# Altium schematic sheet STM.SchDoc
size A4
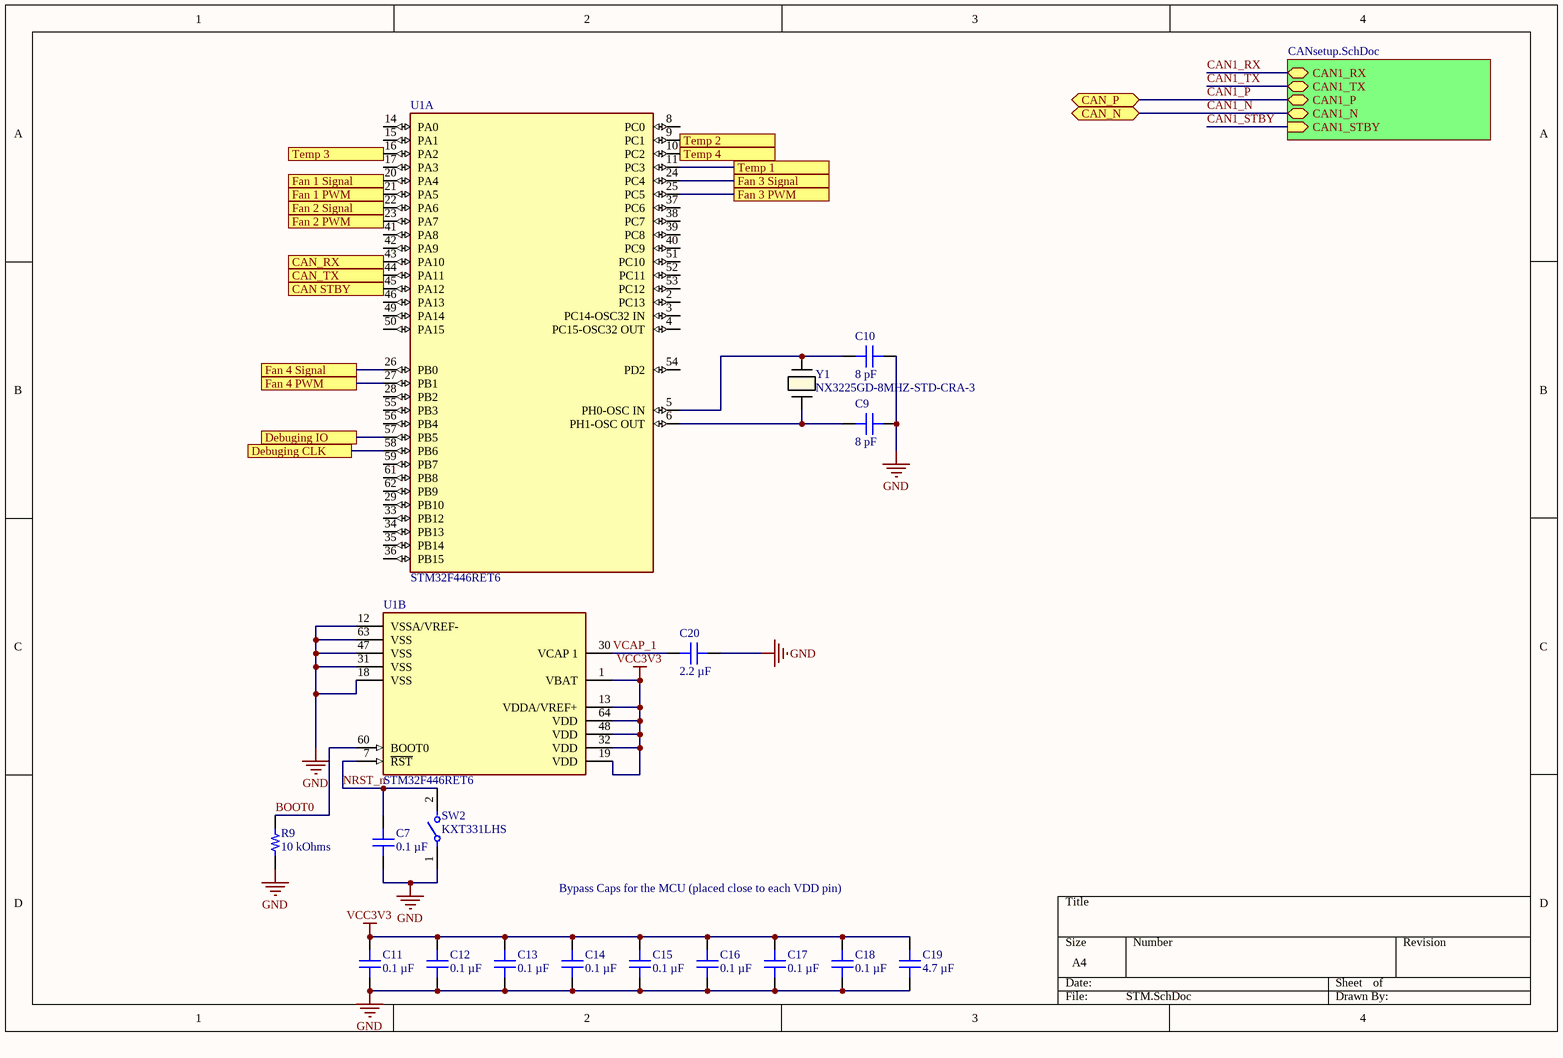
[diagram p0: STM.SchDoc]

## Parts
C7  0.1 µF  [CAP 01005_0402]
C9  8 pF  [CAP 0402_1005]
C10  8 pF  [CAP 0402_1005]
C11  0.1 µF  [CAP 01005_0402]
C12  0.1 µF  [CAP 01005_0402]
C13  0.1 µF  [CAP 01005_0402]
C14  0.1 µF  [CAP 01005_0402]
C15  0.1 µF  [CAP 01005_0402]
C16  0.1 µF  [CAP 01005_0402]
C17  0.1 µF  [CAP 01005_0402]
C18  0.1 µF  [CAP 01005_0402]
C19  4.7 µF  [CAP 0402_1005]
C20  2.2 µF  [CAP 0402_1005]
R9  10 kOhms  [RES 0201_0603]
SW2  KXT331LHS  [FP-KXT331LHS-MFG]
U1  STM32F446RET6  [FP-LQFP64-5W-MFG]  (parts A,B of 2)
Y1  NX3225GD-8MHZ-STD-CRA-3  [XTAL_NX3225GD-8MHZ-STD-CRA-3_NDK]

## Sub-sheets
CAN = CANsetup.SchDoc: CAN1_RX (bidir), CAN1_TX (bidir), CAN1_STBY (in), CAN1_P (bidir), CAN1_N (bidir)

## Ports
CAN STBY, CAN_N (bidir), CAN_P (bidir), CAN_RX, CAN_TX, Debuging CLK, Debuging IO, Fan 1 PWM, Fan 1 Signal, Fan 2 PWM, Fan 2 Signal, Fan 3 PWM, Fan 3 Signal, Fan 4 PWM, Fan 4 Signal, Temp 1, Temp 2, Temp 3, Temp 4

## Nets
GND: C7.2 C9.1 C10.1 C11.2 C12.2 C13.2 C14.2 C15.2 C16.2 C17.2 C18.2 C19.1 C20.1 R9.1 SW2.1 U1.12(VSSA/VREF-) U1.18(VSS) U1.31(VSS) U1.47(VSS) U1.63(VSS)
VCC3V3: C11.1 C12.1 C13.1 C14.1 C15.1 C16.1 C17.1 C18.1 C19.2 U1.1(VBAT) U1.13(VDDA/VREF+) U1.19(VDD) U1.32(VDD) U1.48(VDD) U1.64(VDD)
BOOT0: R9.2 U1.60(BOOT0)
CAN1_N: port CAN_N, sheet CAN/CAN1_N
CAN1_P: port CAN_P, sheet CAN/CAN1_P
CAN1_RX: sheet CAN/CAN1_RX
CAN1_STBY: sheet CAN/CAN1_STBY
CAN1_TX: sheet CAN/CAN1_TX
CAN STBY: U1.45(PA12) ; port CAN STBY
CAN_RX: U1.43(PA10) ; port CAN_RX
CAN_TX: U1.44(PA11) ; port CAN_TX
Debuging CLK: U1.58(PB6) ; port Debuging CLK
Debuging IO: U1.57(PB5) ; port Debuging IO
Fan 1 PWM: U1.21(PA5) ; port Fan 1 PWM
Fan 1 Signal: U1.20(PA4) ; port Fan 1 Signal
Fan 2 PWM: U1.23(PA7) ; port Fan 2 PWM
Fan 2 Signal: U1.22(PA6) ; port Fan 2 Signal
Fan 3 PWM: U1.25(PC5) ; port Fan 3 PWM
Fan 3 Signal: U1.24(PC4) ; port Fan 3 Signal
Fan 4 PWM: U1.27(PB1) ; port Fan 4 PWM
Fan 4 Signal: U1.26(PB0) ; port Fan 4 Signal
NRST_n: C7.1 SW2.2 U1.7(~{RST})
Temp 1: U1.11(PC3) ; port Temp 1
Temp 2: U1.9(PC1) ; port Temp 2
Temp 3: U1.16(PA2) ; port Temp 3
Temp 4: U1.10(PC2) ; port Temp 4
VCAP_1: C20.2 U1.30(VCAP_1)
NetC9_2: C9.2 U1.6(PH1-OSC_OUT) Y1.2
NetC10_2: C10.2 U1.5(PH0-OSC_IN) Y1.1

Not connected (* = marked no-connect by the designer): U1 2(PC13) 3(PC14-OSC32_IN) 4(PC15-OSC32_OUT) 8(PC0) 14(PA0) 15(PA1) 17(PA3) 28(PB2) 29(PB10) 33(PB12) 34(PB13) 35(PB14) 36(PB15) 37(PC6) 38(PC7) 39(PC8) 40(PC9) 41(PA8) 42(PA9) 46(PA13) 49(PA14) 50(PA15) 51(PC10) 52(PC11) 53(PC12) 54(PD2) 55(PB3) 56(PB4) 59(PB7) 61(PB8) 62(PB9)

## Notes on the sheet
- Bypass Caps for the MCU (placed close to each VDD pin)

## Library data of the parts
C7 C11-C18 = CL02A104KQ2NNNC: CAP CER 0.1UF 6.3V X5R 01005; manufacturer: Samsung Electro-Mechanics; Tolerance: ±10%; Part Number: CL02A104KQ2NNNC; Value: 0.1 µF; Applications: General Purpose; Capacitance: 0.1 µF; componentlink1description: Datasheet; componentlink1url: http://www.samsungsem.com/kr/support/product-search/mlcc/CL02A104KQ2NNNC.jsp; componentlink2description: DigiKey Link; componentlink2url: https://www.digikey.com/en/products/detail/samsung-electro-mechanics/CL02A104KQ2NNNC/3886867; Device Package: 01005 (0402 Metric); lastupdated: 2023-11-30 9:46:05 PM; Lifecycle Status: Active; Minimum Order: 1; Mounting Type: Surface Mount, MLCC; Operating Temperature: -55°C ~ 85°C; Package / Case: 01005 (0402 Metric); packaging: TapeAndReel; Part Status: Active; price: 0.02; series: CL; Size / Dimension: 0.016" L x 0.008" W (0.40mm x 0.20mm); Supplier 1: DigiKey; Supplier Part Number 1: 1276-1209-1-ND; Temperature Coefficient: X5R; Thickness (Max): 0.009" (0.22mm); Voltage - Rated: 6.3V
C9 C10 = GCM1555C1H8R0FA16D: CAP CER 8PF 50V C0G/NP0 0402; manufacturer: Murata Electronics; Temperature Coefficient: C0G, NP0; Tolerance: ±1%; Part Number: GCM1555C1H8R0FA16D; Value: 8 pF; Applications: Automotive; Capacitance: 8 pF; componentlink1description: Datasheet; componentlink1url: https://search.murata.co.jp/Ceramy/image/img/A01X/G101/ENG/GCM1555C1H8R0FA16-01.pdf; componentlink2description: DigiKey Link; componentlink2url: https://www.digikey.com/en/products/detail/murata-electronics/GCM1555C1H8R0FA16D/11618789; Device Package: 0402 (1005 Metric); lastupdated: 2024-01-11 8:04:05 PM; Lifecycle Status: Active; Minimum Order: 1; Mounting Type: Surface Mount, MLCC; Operating Temperature: -55°C ~ 125°C; Package / Case: 0402 (1005 Metric); packaging: TapeAndReel; partid: 34002; Part Status: Active; price: 0.01; Ratings: AEC-Q200; series: GCM; Size / Dimension: 0.039" L x 0.020" W (1.00mm x 0.50mm); Supplier 1: DigiKey; Supplier Part Number 1: 490-GCM1555C1H8R0FA16DCT-ND; Thickness (Max): 0.022" (0.55mm); Voltage - Rated: 50V
C19 = CL05A475MO5NUNC: CAP CER 4.7UF 16V X5R 0402; manufacturer: Samsung Electro-Mechanics; Tolerance: ±20%; Part Number: CL05A475MO5NUNC; Value: 4.7 µF; Applications: General Purpose; Capacitance: 4.7 µF; componentlink1description: Datasheet; componentlink1url: http://www.samsungsem.com/kr/support/product-search/mlcc/__icsFiles/afieldfile/2019/05/29/Data%20sheet_CL05A475MO5NUNC.pdf; componentlink2description: DigiKey Link; componentlink2url: https://www.digikey.com/en/products/detail/samsung-electro-mechanics/CL05A475MO5NUNC/5961320; Device Package: 0402 (1005 Metric); lastupdated: 2024-01-11 8:04:27 PM; Lifecycle Status: Active; Minimum Order: 1; Mounting Type: Surface Mount, MLCC; Operating Temperature: -55°C ~ 85°C; Package / Case: 0402 (1005 Metric); packaging: TapeAndReel; partid: 1760; Part Status: Active; price: 0.08; series: CL; Size / Dimension: 0.039" L x 0.020" W (1.00mm x 0.50mm); Supplier 1: DigiKey; Supplier Part Number 1: 1276-6836-1-ND; Temperature Coefficient: X5R; Thickness (Max): 0.028" (0.70mm); Voltage - Rated: 16V
C20 = CL05A225KO5NQNC: CAP CER 2.2UF 16V X5R 0402; manufacturer: Samsung Electro-Mechanics; Tolerance: ±10%; Part Number: CL05A225KO5NQNC; Value: 2.2 µF; Applications: General Purpose; Capacitance: 2.2 µF; componentlink1description: Datasheet; componentlink1url: http://www.samsungsem.com/kr/support/product-search/mlcc/CL05A225KO5NQNC.jsp; componentlink2description: DigiKey Link; componentlink2url: https://www.digikey.com/en/products/detail/samsung-electro-mechanics/CL05A225KO5NQNC/3887119; Device Package: 0402 (1005 Metric); lastupdated: 2024-01-11 8:04:27 PM; Lifecycle Status: Active; Minimum Order: 1; Mounting Type: Surface Mount, MLCC; Operating Temperature: -55°C ~ 85°C; Package / Case: 0402 (1005 Metric); packaging: TapeAndReel; partid: 1761; Part Status: Active; price: 0.03; series: CL; Size / Dimension: 0.039" L x 0.020" W (1.00mm x 0.50mm); Supplier 1: DigiKey; Supplier Part Number 1: 1276-1461-1-ND; Temperature Coefficient: X5R; Thickness (Max): 0.022" (0.55mm); Voltage - Rated: 16V
R9 = CRCW020110K0FKED: RES SMD 10K OHM 1% 1/20W 0201; Manufacturer: Vishay Dale; Power (Watts): 0.05W, 1/20W; Temperature Coefficient: ±100ppm/°C; Part Number: CRCW020110K0FKED; Value: 10 kOhms; ComponentLink1Description: Datasheet; ComponentLink1URL: http://www.vishay.com/docs/20052/crcw0201e3.pdf; ComponentLink2Description: DigiKey Link; ComponentLink2URL: https://www.digikey.com/en/products/detail/vishay-dale/CRCW020110K0FKED/1967989; Composition: Thick Film; Device Package: 0201 (0603 Metric); Height - Seated (Max): 0.010" (0.26mm); LastUpdated: 2024-01-11 8:21:19 PM; Lifecycle Status: Active; Minimum Order: 1; Number of Terminations: 2; Operating Temperature: -55°C ~ 155°C; Package / Case: 0201 (0603 Metric); Packaging: TapeAndReel; PartId: 29; Part Status: Active; Price: 0.02; Resistance: 10 kOhms; Series: CRCW; Size / Dimension: 0.024" L x 0.012" W (0.60mm x 0.30mm); Supplier 1: DigiKey; Supplier Part Number 1: 541-10.0KAABCT-ND; Supplier Device Package: 0201; Tolerance: ±1%
SW2 = CMP-10040-000029-1: SWITCH TACTILE SPST-NO 0.02A 15V; Operating Force: 240gf; Switch Travel: 0.13mm; Illumination Type: Non-Illuminated; Throw Configuration: SPST; Number of Ports: 1; Current Rating: 5A; Mechanical Life: 500000Cycles; Switch Function: Off-Mom; Connector Type: USB; Actuator Type: Standard; Gender: Receptacle; Number of Contacts: 24; Contact Plating: Gold; Insulation Color: Black; Min Operating Temperature: -40°C; Packaging: Tape and Reel; Flammability Rating: UL94 V-0; Max Operating Temperature: 85°C; Termination: Solder; Mount: Surface Mount
U1 = CMP-12105-000007-1: IC MCU 32BIT 512KB FLASH 64LQFP; Manufacturer: ST; Number Of Spi Channels: 4; Ram Size: 128KBytes; Standoff Height: 0.05mm; Number Of Uart Channels: 6; Number Of Pwm Channels: 32; Max Junction Temp: +105°C; Number Of I/Os: 50; Number Of Usb Channels: 2; Frequency: 180MHz; Number Of A/D Converters: 3; Max Supply Voltage: 3.6V; Number Of Adc Channels: 16; Interface: I2C,SPI,UART,USART,CAN,USB,LIN,IrDA,I2S,Other; Memory Size: 512KBytes; Number Of Timers/Counters: 14; Min Supply Voltage: 1.7V; Core Architecture: ARM Cortex-M4; Data Bus Width: 32bits; Number Of Cores: 1; Ambient Temperature Range Low: -40°C; ComponentLink2URL: https://www.st.com/en/microcontrollers-microprocessors/stm32f446re.html; Category: IC; Height: 1.6mm; Ipc Land Pattern Name: QFP50P1200X1200X160-64; Manufacturer Part Number: STM32F446RET6; Octopart: https://octopart.com/stm32f446ret6-stmicroelectronics-52642920; Temperature Range High: +105°C; Lead Free: Yes; Mouser Description: ARM Microcontrollers - MCU High-performance and DSP with FP, ARM Cortex-M4 MCU with 512 Kbytes Flash, 180 MHz CPU, Art Accelerator, SDRAM; Digikey Description: IC MCU 32BIT 512KB FLASH 64LQFP; Ambient Temperature Range High: +85°C; Number Of I2C Channels: 4; Memory Type: FLASH; RoHS: TRUE; Automotive: No; Device Class L1: Integrated Circuits (ICs); Temperature: -40°C to +105°C; Device Class L2: Embedded Processors and Controllers; Device Class L3: Microcontrollers; Temperature Range Low: -40°C; Package: LQFP64-5W; ComponentLink2Description: Datasheet
Y1 = NX3225GD-8MHZ-STD-CRA-3: No Description Available; Mfr_Name: NDK; Copyright: Copyright (C) 2024 Ultra Librarian. All rights reserved.; Manufacturer_Part_Number: NX3225GD-8MHZ-STD-CRA-3; RefDes: RefDes; Type: DEV